# EAGLE schematic VCAMatrixTop (EAGLE 7.5.0)
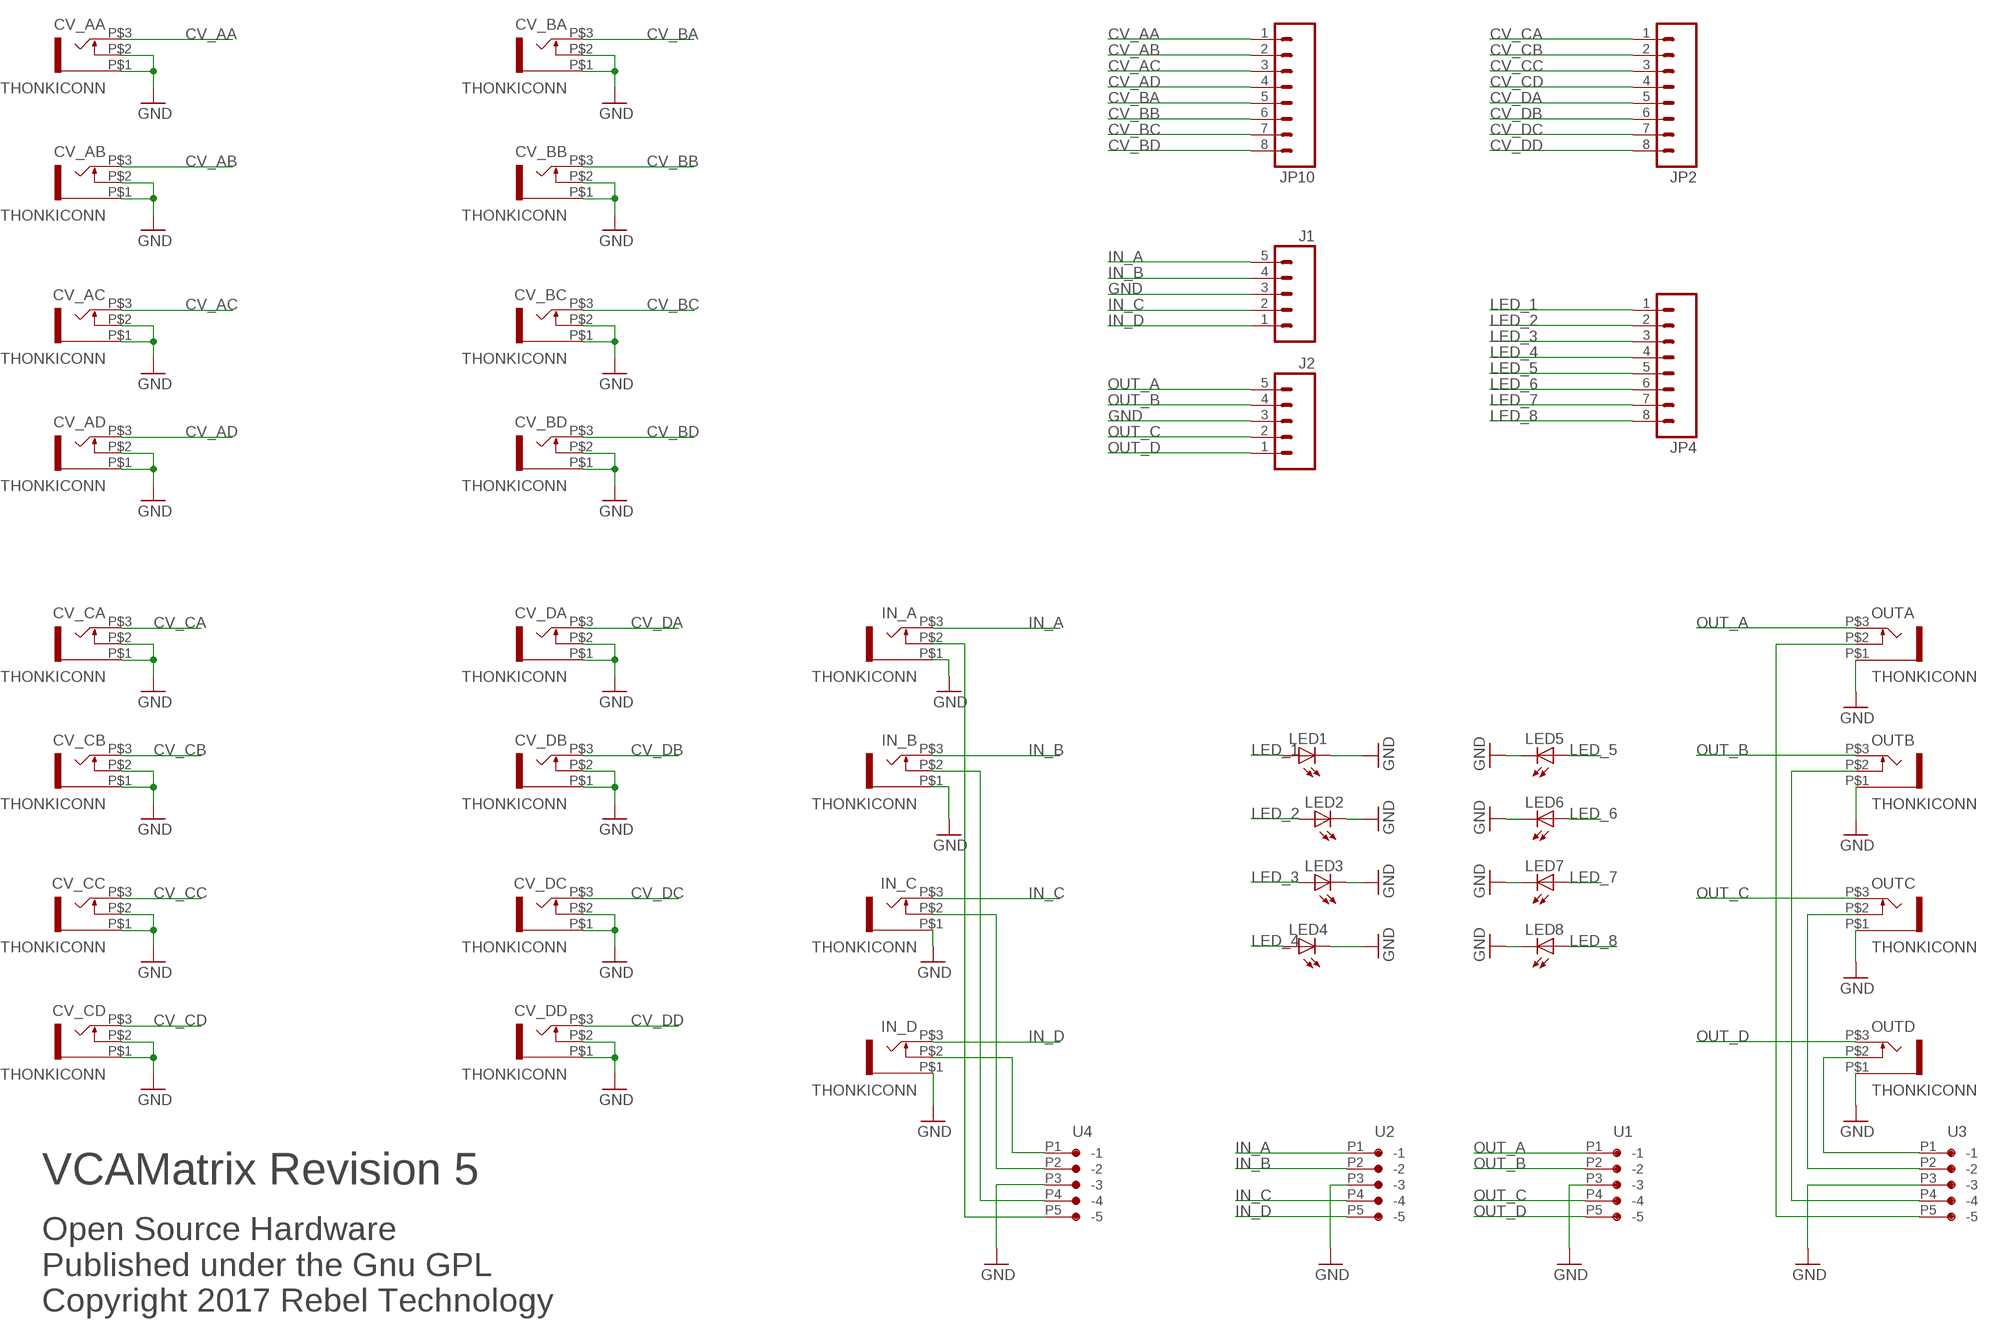
[diagram p0: schematic, sheet 1]

## Parts
CV_AA  THONKICONN  [THONKICONN]
CV_AB  THONKICONN  [THONKICONN]
CV_AC  THONKICONN  [THONKICONN]
CV_AD  THONKICONN  [THONKICONN]
CV_BA  THONKICONN  [THONKICONN]
CV_BB  THONKICONN  [THONKICONN]
CV_BC  THONKICONN  [THONKICONN]
CV_BD  THONKICONN  [THONKICONN]
CV_CA  THONKICONN  [THONKICONN]
CV_CB  THONKICONN  [THONKICONN]
CV_CC  THONKICONN  [THONKICONN]
CV_CD  THONKICONN  [THONKICONN]
CV_DA  THONKICONN  [THONKICONN]
CV_DB  THONKICONN  [THONKICONN]
CV_DC  THONKICONN  [THONKICONN]
CV_DD  THONKICONN  [THONKICONN]
IN_A  THONKICONN  [THONKICONN]
IN_B  THONKICONN  [THONKICONN]
IN_C  THONKICONN  [THONKICONN]
IN_D  THONKICONN  [THONKICONN]
J1  M05PTH  [1X05]
J2  M05PTH  [1X05]
JP2  M081X08  [1X08]
JP4  M081X08  [1X08]
JP10  M081X08  [1X08]
LED1  LED3MM  [LED3MM]
LED2  LED3MM  [LED3MM]
LED3  LED3MM  [LED3MM]
LED4  LED3MM  [LED3MM]
LED5  LED3MM  [LED3MM]
LED6  LED3MM  [LED3MM]
LED7  LED3MM  [LED3MM]
LED8  LED3MM  [LED3MM]
OUTA  THONKICONN  [THONKICONN]
OUTB  THONKICONN  [THONKICONN]
OUTC  THONKICONN  [THONKICONN]
OUTD  THONKICONN  [THONKICONN]
U1  CON-JST_PH_5W  [CON-JST_PH_5W]
U2  CON-JST_PH_5W  [CON-JST_PH_5W]
U3  CON-JST_PH_5W  [CON-JST_PH_5W]
U4  CON-JST_PH_5W  [CON-JST_PH_5W]

## Nets
CV_AA: CV_AA.P$3 JP10.1
CV_AB: CV_AB.P$3 JP10.2
CV_AC: CV_AC.P$3 JP10.3
CV_AD: CV_AD.P$3 JP10.4
CV_BA: CV_BA.P$3 JP10.5
CV_BB: CV_BB.P$3 JP10.6
CV_BC: CV_BC.P$3 JP10.7
CV_BD: CV_BD.P$3 JP10.8
CV_CA: CV_CA.P$3 JP2.1
CV_CB: CV_CB.P$3 JP2.2
CV_CC: CV_CC.P$3 JP2.3
CV_CD: CV_CD.P$3 JP2.4
CV_DA: CV_DA.P$3 JP2.5
CV_DB: CV_DB.P$3 JP2.6
CV_DC: CV_DC.P$3 JP2.7
CV_DD: CV_DD.P$3 JP2.8
GND: CV_AA.P$1 CV_AA.P$2 CV_AB.P$1 CV_AB.P$2 CV_AC.P$1 CV_AC.P$2 CV_AD.P$1 CV_AD.P$2 CV_BA.P$1 CV_BA.P$2 CV_BB.P$1 CV_BB.P$2 CV_BC.P$1 CV_BC.P$2 CV_BD.P$1 CV_BD.P$2 CV_CA.P$1 CV_CA.P$2 CV_CB.P$1 CV_CB.P$2 CV_CC.P$1 CV_CC.P$2 CV_CD.P$1 CV_CD.P$2 CV_DA.P$1 CV_DA.P$2 CV_DB.P$1 CV_DB.P$2 CV_DC.P$1 CV_DC.P$2 CV_DD.P$1 CV_DD.P$2 IN_A.P$1 IN_B.P$1 IN_C.P$1 IN_D.P$1 J1.3 J2.3 LED1.K(C) LED2.K(C) LED3.K(C) LED4.K(C) LED5.K(C) LED6.K(C) LED7.K(C) LED8.K(C) OUTA.P$1 OUTB.P$1 OUTC.P$1 OUTD.P$1 U1.P3(-3) U2.P3(-3) U3.P3(-3) U4.P3(-3)
IN_A: IN_A.P$3 J1.5 U2.P1(-1)
IN_B: IN_B.P$3 J1.4 U2.P2(-2)
IN_C: IN_C.P$3 J1.2 U2.P4(-4)
IN_D: IN_D.P$3 J1.1 U2.P5(-5)
LED_1: JP4.1 LED1.A
LED_2: JP4.2 LED2.A
LED_3: JP4.3 LED3.A
LED_4: JP4.4 LED4.A
LED_5: JP4.5 LED5.A
LED_6: JP4.6 LED6.A
LED_7: JP4.7 LED7.A
LED_8: JP4.8 LED8.A
N$55: OUTA.P$2 U3.P5(-5)
N$70: IN_B.P$2 U4.P4(-4)
N$71: IN_C.P$2 U4.P2(-2)
N$72: IN_D.P$2 U4.P1(-1)
N$73: OUTB.P$2 U3.P4(-4)
N$74: OUTC.P$2 U3.P2(-2)
N$75: OUTD.P$2 U3.P1(-1)
N$76: IN_A.P$2 U4.P5(-5)
OUT_A: J2.5 OUTA.P$3 U1.P1(-1)
OUT_B: J2.4 OUTB.P$3 U1.P2(-2)
OUT_C: J2.2 OUTC.P$3 U1.P4(-4)
OUT_D: J2.1 OUTD.P$3 U1.P5(-5)

## Notes on the sheet
- VCAMatrix Revision 5
- Open Source Hardware
  Published under the Gnu GPL
  Copyright 2017 Rebel Technology

## Library data of the parts
CV_AA CV_AB CV_AC CV_AD CV_BA CV_BB CV_BC CV_BD CV_CA CV_CB CV_CC CV_CD CV_DA CV_DB CV_DC CV_DD IN_A IN_B IN_C IN_D OUTA OUTB OUTC OUTD = Rebel:THONKICONN
J1 J2 = SparkFun-Connectors:M05: Header 5 Standard 5-pin 0.1" header. Use with straight break away headers (SKU : PRT-00116), right angle break away headers (PRT-00553), swiss pins (PRT-00743), machine pins (PRT-00117), and female headers (PRT-00115). Molex polarized connector foot print use with SKU : PRT-08230 with associated crimp pins and housings.
JP2 JP4 JP10 = SparkFun:M08: Header 8 Standard 8-pin 0.1" header. Use with straight break away headers (SKU : PRT-00116), right angle break away headers (PRT-00553), swiss pins (PRT-00743), machine pins (PRT-00117), and female headers (PRT-00115).
LED1-LED8 = adafruit:LED: LED OSRAM: - CHIPLED LG R971, LG N971, LY N971, LG Q971, LY Q971, LO R971, LY R971 LH N974, LH R974 LS Q976, LO Q976, LY Q976 LO Q996 - Hyper CHIPLED LW Q18S LB Q993, LB Q99A, LB R99A - SideLED LS A670, LO A670, LY A670, LG A670, LP A670 LB A673, LV A673, LT A673, LW A673 LH A674 LY A675 LS A676, LA A676, LO A676, LY A676, LW A676 LS A679, LY A679, LG A679 - Hyper Micro SIDELED® LS Y876, LA Y876, LO Y876, LY Y876 LT Y87S - SmartLED LW L88C, LW L88S LB L89C, LB L89S, LG L890 LS L89K, LO L89K, LY L89K LS L896, LA L896, LO L896, LY L896 - TOPLED LS T670, LO T670, LY T670, LG T670, LP T670 LSG T670, LSP T670, LSY T670, LOP T670, LYG T670 LG T671, LOG T671, LSG T671 LB T673, LV T673, LT T673, LW T673 LH T674 LS T676, LA T676, LO T676, LY T676, LB T676, LH T676, LSB T676, LW T676 LB T67C, LV T67C, LT T67C, LS T67K, LO T67K, LY T67K, LW E67C LS E67B, LA E67B, LO E67B, LY E67B, LB E67C, LV E67C, LT E67C LW T67C LS T679, LY T679, LG T679 LS T770, LO T770, LY T770, LG T770, LP T770 LB T773, LV T773, LT T773, LW T773 LH T774 LS E675, LA E675, LY E675, LS T675 LS T776, LA T776, LO T776, LY T776, LB T776 LHGB T686 LT T68C, LB T68C - Hyper Mini TOPLED® LB M676 - Mini TOPLED Santana® LG M470 LS M47K, LO M47K, LY M47K Source: http://www.osram.convergy.de/
U1-U4 = Rebel:CON-JST_PH_5W

## Module VCA
Ports: AUDIO_IN(in) CV_A(in) CV_B(in) CV_C(in) CV_D(in) OUT_A(out) OUT_B(out) OUT_C(out) OUT_D(out) +12V(pwr) -12V(pwr) GND(pwr) OFFSET_REF(in) CLAMP_REF(io)

### Library data of the parts